# EAGLE design expansion_board_vias (EAGLE 7.5.0)
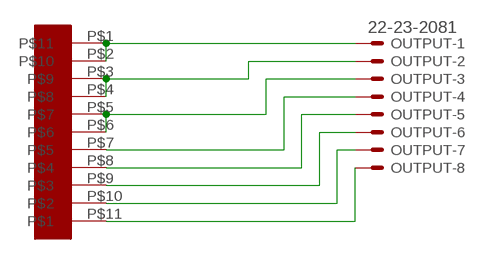
[diagram p0: schematic, sheet 1]

## Parts
OUTPUT  22-23-2081  [22-23-2081]
U$1  MOLEX52207  [MOLEX52207]

## Nets
N$1: OUTPUT.8 U$1.P$11
N$2: OUTPUT.7 U$1.P$10
N$3: OUTPUT.6 U$1.P$9
N$4: OUTPUT.5 U$1.P$8
N$5: OUTPUT.4 U$1.P$7
N$6: OUTPUT.3 U$1.P$5 U$1.P$6
N$7: OUTPUT.2 U$1.P$3 U$1.P$4
N$8: OUTPUT.1 U$1.P$1 U$1.P$2

## Library data of the parts
OUTPUT = con-molex:22-23-2081: .100" (2.54mm) Center Header - 8 Pin; MF: MOLEX; MPN: 22-23-2081; OC_FARNELL: 1756826; OC_NEWARK: 01C7592
U$1 = custom-components:MOLEX52207

## Board
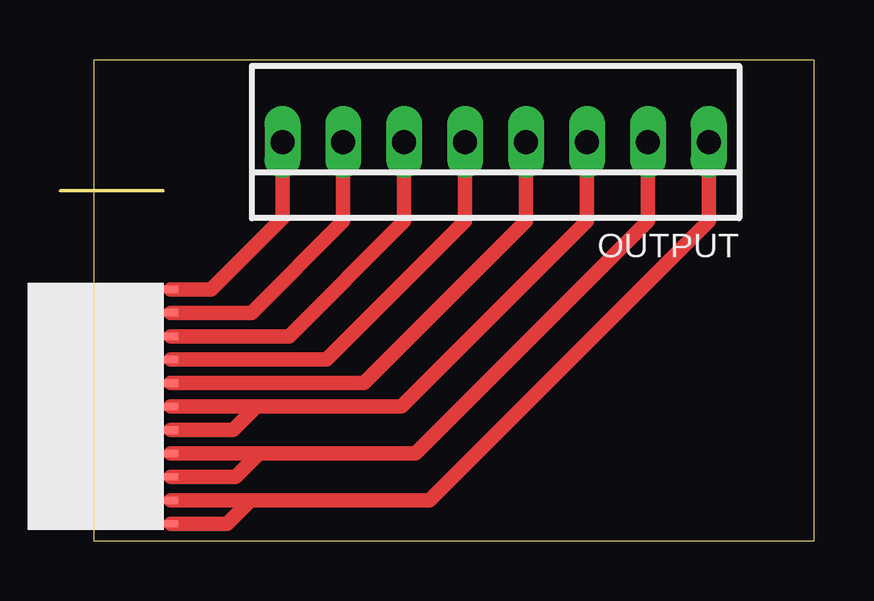
[diagram p1: board, top side]

Size 31.42 x 20.06 mm. Coordinates in mm from the lower left corner, seen from the top.
Outline: 31.42,0 1.4,0 1.4,20.06 31.42,20.06
Outline: 31.42,0 31.42,0
Outline: 31.42,20.06 31.42,20.06
Outline: 31.42,20.06 31.42,0
Copper layers (1*16): Top 0.035mm / dielectric 1.5mm / Bottom 0.035mm
Design rules "default": minimum track width 10mil, minimum drill 24mil, track to track 8mil, track to pad 8mil, pad to pad 8mil, via to via 8mil, smd to smd 8mil, copper to edge 40mil, drill to drill 8mil, minimum pad ring 10mil, minimum via ring 8mil, stop-mask expansion 4mil, vias tented up to drill 0mil, thermal gap 10mil

### Footprints (pad centres in the part's own frame; a part is rotated, then mirrored left to right if it is on the bottom)
22-23-2081 = drill 1 long: 1 -8.89,0; 2 -6.35,0; 3 -3.81,0; 4 -1.27,0; 5 1.27,0; 6 3.81,0; 7 6.35,0; 8 8.89,0
MOLEX52207 = smd 0.61 x 0.305: P$1 0.305,-5.004; P$2 0.305,-4.026; P$3 0.305,-3.048; P$4 0.305,-2.07; P$5 0.305,-1.092; P$6 0.305,-0.114; P$7 0.305,0.864; P$8 0.305,1.841; P$9 0.305,2.819; P$10 0.305,3.797; P$11 0.305,4.775

### Placement (x,y rotation side)
OUTPUT  18.16,16.64 180 top
U$1  4.32,5.72 0 top

### Tracks (layer width: path | path; a pad name or v marks a point on that pad's centre or on a via)
N$1
  Top 0.61: U$1.P$11 6.3,10.49 9.27,13.46 OUTPUT.8
N$2
  Top 0.61: U$1.P$10 7.99,9.51 11.81,13.33 OUTPUT.7
N$3
  Top 0.61: U$1.P$9 9.55,8.53 14.35,13.33 OUTPUT.6
N$4
  Top 0.61: U$1.P$8 11.11,7.56 16.89,13.33 OUTPUT.5
N$5
  Top 0.61: U$1.P$7 12.67,6.58 19.43,13.33 OUTPUT.4
N$6
  Top 0.61: U$1.P$6 8.2,5.6 | 8.2,5.6 14.24,5.6 21.97,13.33 OUTPUT.3 | U$1.P$5 7.23,4.62 8.2,5.6
N$7
  Top 0.61: U$1.P$4 8.31,3.64 | 8.31,3.64 14.82,3.64 24.51,13.33 OUTPUT.2 | U$1.P$3 7.33,2.67 8.31,3.64
N$8
  Top 0.61: U$1.P$2 7.95,1.69 | 7.95,1.69 15.4,1.69 27.05,13.33 OUTPUT.1 | U$1.P$1 6.97,0.71 7.95,1.69